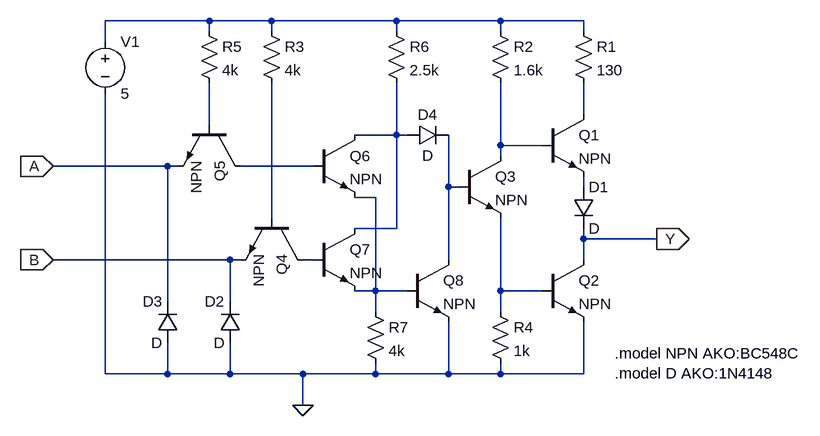
[diagram p0: schematic OR.asc]
OR.asc, the LTspice schematic file:
Version 4
SHEET 1 880 680
WIRE -128 -80 -288 -80
WIRE -32 -80 -128 -80
WIRE 160 -80 -32 -80
WIRE 320 -80 160 -80
WIRE 448 -80 320 -80
WIRE -128 -64 -128 -80
WIRE -32 -64 -32 -80
WIRE 160 -64 160 -80
WIRE 320 -64 320 -80
WIRE 448 -64 448 -80
WIRE -288 -48 -288 -80
WIRE 448 64 448 16
WIRE -128 80 -128 16
WIRE 160 96 160 16
WIRE 160 96 96 96
WIRE 176 96 160 96
WIRE 320 112 320 16
WIRE 384 112 320 112
WIRE 320 128 320 112
WIRE -192 144 -368 144
WIRE -176 144 -192 144
WIRE 32 144 -80 144
WIRE 240 176 240 96
WIRE 256 176 240 176
WIRE 448 176 448 160
WIRE 128 192 96 192
WIRE -32 224 -32 16
WIRE 160 240 160 96
WIRE 160 240 96 240
WIRE 448 256 448 240
WIRE 560 256 448 256
WIRE -96 288 -368 288
WIRE -80 288 -96 288
WIRE 32 288 16 288
WIRE 240 288 240 176
WIRE 448 288 448 256
WIRE 128 336 128 192
WIRE 128 336 96 336
WIRE 176 336 128 336
WIRE 320 336 320 224
WIRE 384 336 320 336
WIRE -192 352 -192 144
WIRE -96 352 -96 288
WIRE 128 368 128 336
WIRE 320 368 320 336
WIRE -288 464 -288 32
WIRE -192 464 -192 416
WIRE -192 464 -288 464
WIRE -96 464 -96 416
WIRE -96 464 -192 464
WIRE 16 464 -96 464
WIRE 128 464 128 448
WIRE 128 464 16 464
WIRE 240 464 240 384
WIRE 240 464 128 464
WIRE 320 464 320 448
WIRE 320 464 240 464
WIRE 448 464 448 384
WIRE 448 464 320 464
WIRE 16 512 16 464
FLAG 16 512 0
FLAG -368 288 B
IOPIN -368 288 In
FLAG 560 256 Y
IOPIN 560 256 Out
FLAG -368 144 A
IOPIN -368 144 In
SYMBOL npn 384 64 R0
SYMATTR InstName Q1
SYMBOL npn 384 288 R0
SYMATTR InstName Q2
SYMBOL npn 256 128 R0
SYMATTR InstName Q3
SYMBOL npn 16 224 R90
SYMATTR InstName Q4
SYMBOL res 432 -80 R0
SYMATTR InstName R1
SYMATTR Value 130
SYMBOL res 304 -80 R0
SYMATTR InstName R2
SYMATTR Value 1.6k
SYMBOL res -48 -80 R0
SYMATTR InstName R3
SYMATTR Value 4k
SYMBOL res 304 352 R0
SYMATTR InstName R4
SYMATTR Value 1k
SYMBOL diode 432 176 R0
SYMATTR InstName D1
SYMBOL diode -80 416 R180
WINDOW 0 24 64 Left 2
WINDOW 3 24 0 Left 2
SYMATTR InstName D2
SYMBOL voltage -288 -64 R0
WINDOW 123 0 0 Left 2
WINDOW 39 0 0 Left 2
SYMATTR InstName V1
SYMATTR Value 5
SYMBOL npn -80 80 R90
SYMATTR InstName Q5
SYMBOL diode -176 416 R180
WINDOW 0 24 64 Left 2
WINDOW 3 24 0 Left 2
SYMATTR InstName D3
SYMBOL res -144 -80 R0
SYMATTR InstName R5
SYMATTR Value 4k
SYMBOL res 144 -80 R0
SYMATTR InstName R6
SYMATTR Value 2.5k
SYMBOL diode 176 112 R270
WINDOW 0 32 32 VTop 2
WINDOW 3 0 32 VBottom 2
SYMATTR InstName D4
SYMBOL npn 32 96 R0
SYMATTR InstName Q6
SYMBOL npn 32 240 R0
SYMATTR InstName Q7
SYMBOL npn 176 288 R0
SYMATTR InstName Q8
SYMBOL res 112 352 R0
SYMATTR InstName R7
SYMATTR Value 4k
TEXT 496 432 Left 2 !.model NPN AKO:BC548C\n.model D AKO:1N4148

The netlist it stands for:
* OR.asc
Q1 N002 N005 N008 0 NPN
Q2 Y N012 0 0 NPN
Q3 N005 N007 N012 0 NPN
Q4 N011 N010 B 0 NPN
R1 N001 N002 130
R2 N001 N005 1.6k
R3 N001 N010 4k
R4 N012 0 1k
D1 N008 Y D
D2 0 B D
V1 N001 0 5
Q5 N006 N003 A 0 NPN
D3 0 A D
R5 N001 N003 4k
R6 N001 N004 2.5k
D4 N004 N007 D
Q6 N004 N006 N009 0 NPN
Q7 N004 N011 N009 0 NPN
Q8 N007 N009 0 0 NPN
R7 N009 0 4k
.model D D
.lib standard.dio
.model NPN NPN
.model PNP PNP
.lib standard.bjt
.model NPN AKO:BC548C
.model D AKO:1N4148
.backanno
.end